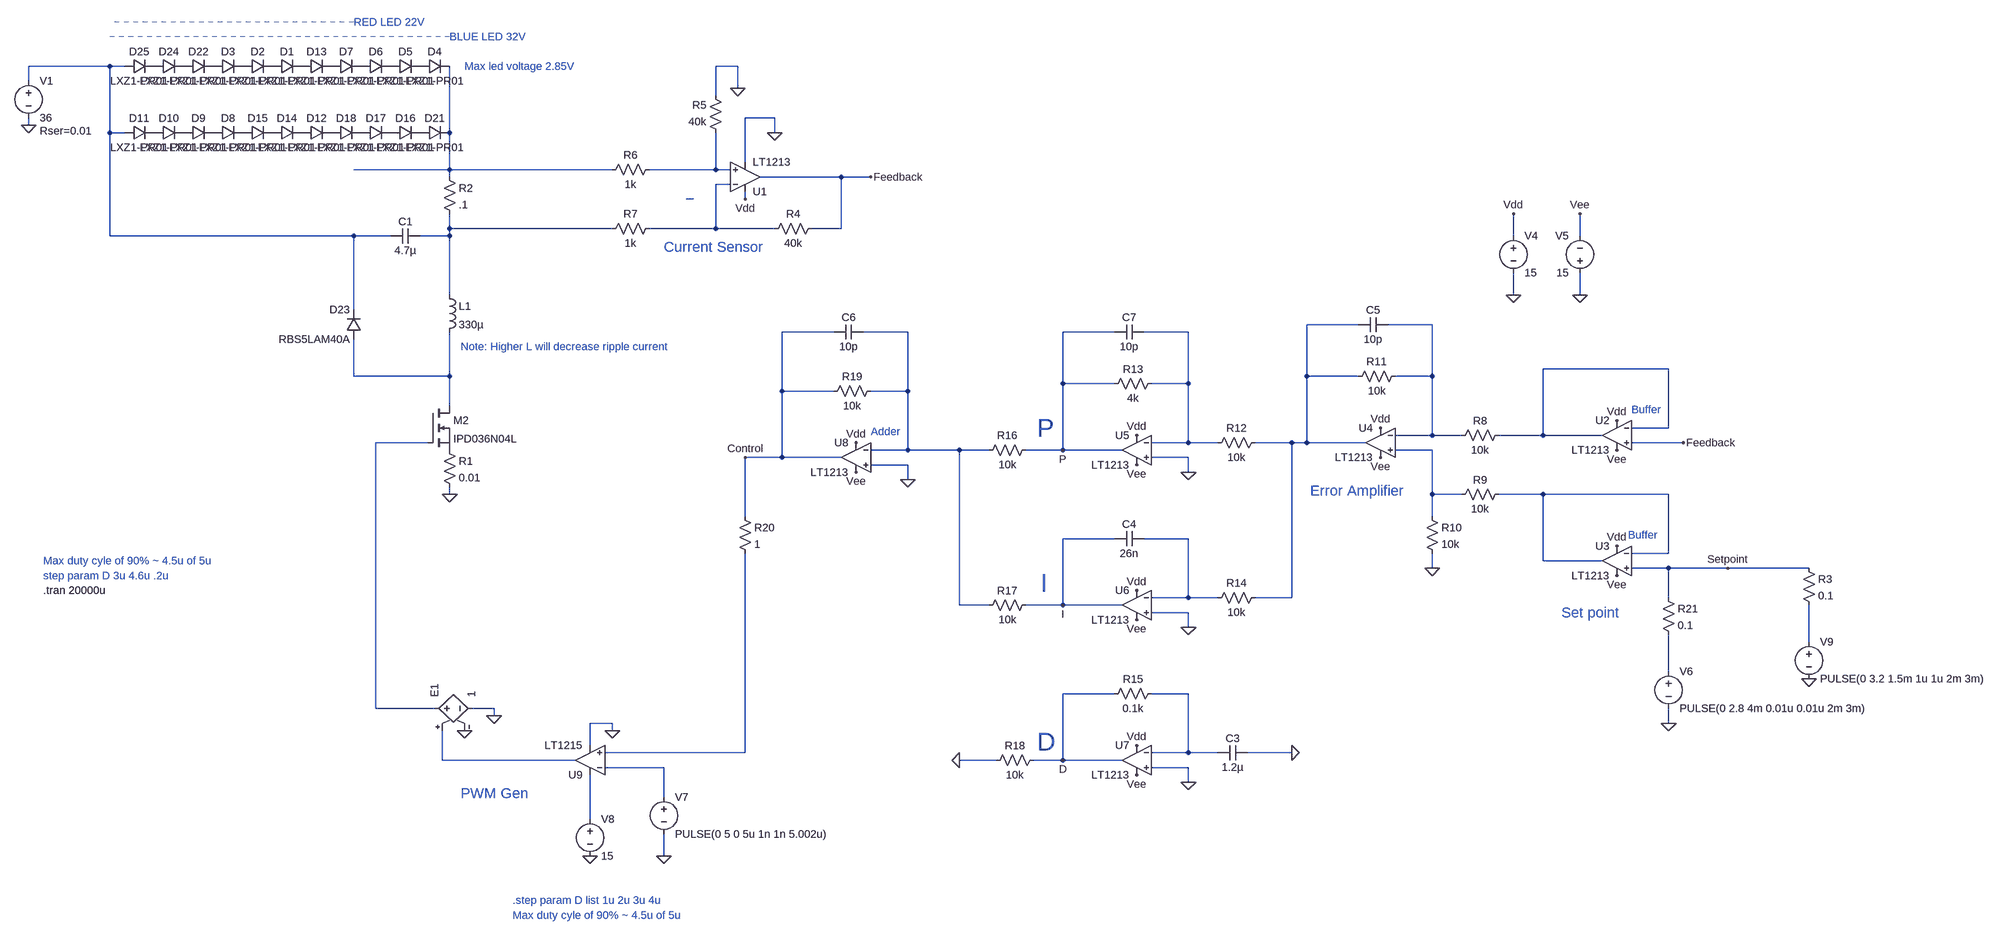
[diagram p0: schematic BuckConvertorTestsV3.asc]
BuckConvertorTestsV3.asc, the LTspice schematic file:
Version 4.1
SHEET 1 5836 2960
WIRE -480 512 -656 512
WIRE -448 512 -480 512
WIRE 880 512 832 512
WIRE -656 544 -656 512
WIRE 880 560 880 512
WIRE 832 576 832 512
WIRE 960 624 896 624
WIRE -656 640 -656 624
WIRE -480 656 -480 512
WIRE -448 656 -480 656
WIRE 256 656 256 512
WIRE 960 656 960 624
WIRE 896 720 896 624
WIRE 256 736 256 656
WIRE 256 736 48 736
WIRE 608 736 256 736
WIRE 832 736 832 656
WIRE 832 736 688 736
WIRE 864 736 832 736
WIRE 256 752 256 736
WIRE 1104 752 928 752
WIRE 1168 752 1104 752
WIRE 864 768 832 768
WIRE 784 800 768 800
WIRE 896 800 896 784
WIRE 256 864 256 832
WIRE 608 864 256 864
WIRE 832 864 832 768
WIRE 832 864 688 864
WIRE 960 864 832 864
WIRE 1104 864 1104 752
WIRE 1104 864 1040 864
WIRE -480 880 -480 656
WIRE 48 880 -480 880
WIRE 128 880 48 880
WIRE 256 880 256 864
WIRE 256 880 192 880
WIRE 2560 880 2560 832
WIRE 2704 880 2704 832
WIRE 256 1008 256 880
WIRE 2560 1008 2560 960
WIRE 2704 1008 2704 960
WIRE 48 1040 48 880
WIRE 2224 1072 2112 1072
WIRE 2384 1072 2288 1072
WIRE 1088 1088 976 1088
WIRE 1248 1088 1152 1088
WIRE 1696 1088 1584 1088
WIRE 1856 1088 1760 1088
WIRE 2896 1168 2624 1168
WIRE 48 1184 48 1104
WIRE 256 1184 256 1088
WIRE 256 1184 48 1184
WIRE 2112 1184 2112 1072
WIRE 2224 1184 2112 1184
WIRE 2384 1184 2384 1072
WIRE 2384 1184 2304 1184
WIRE 1584 1200 1584 1088
WIRE 1696 1200 1584 1200
WIRE 1856 1200 1856 1088
WIRE 1856 1200 1776 1200
WIRE 976 1216 976 1088
WIRE 1088 1216 976 1216
WIRE 1248 1216 1248 1088
WIRE 1248 1216 1168 1216
WIRE 256 1248 256 1184
WIRE 2896 1296 2896 1168
WIRE 2896 1296 2816 1296
WIRE 2384 1312 2384 1184
WIRE 2384 1312 2304 1312
WIRE 2448 1312 2384 1312
WIRE 2624 1312 2624 1168
WIRE 2624 1312 2528 1312
WIRE 2752 1312 2624 1312
WIRE 208 1328 96 1328
WIRE 1856 1328 1856 1200
WIRE 1856 1328 1776 1328
WIRE 1920 1328 1856 1328
WIRE 2080 1328 2000 1328
WIRE 2112 1328 2112 1184
WIRE 2112 1328 2080 1328
WIRE 2240 1328 2112 1328
WIRE 2928 1328 2816 1328
WIRE 1248 1344 1248 1216
WIRE 1248 1344 1168 1344
WIRE 1360 1344 1248 1344
WIRE 1424 1344 1360 1344
WIRE 1584 1344 1584 1200
WIRE 1584 1344 1504 1344
WIRE 1712 1344 1584 1344
WIRE 2384 1344 2304 1344
WIRE 976 1360 976 1216
WIRE 976 1360 896 1360
WIRE 1104 1360 976 1360
WIRE 1856 1360 1776 1360
WIRE 1248 1376 1168 1376
WIRE 1856 1392 1856 1360
WIRE 1248 1408 1248 1376
WIRE 256 1440 256 1424
WIRE 2384 1440 2384 1344
WIRE 2448 1440 2384 1440
WIRE 2624 1440 2528 1440
WIRE 2896 1440 2624 1440
WIRE 896 1488 896 1360
WIRE 2384 1488 2384 1440
WIRE 1696 1536 1584 1536
WIRE 1856 1536 1760 1536
WIRE 2896 1568 2896 1440
WIRE 2896 1568 2816 1568
WIRE 2624 1584 2624 1440
WIRE 2752 1584 2624 1584
WIRE 2384 1600 2384 1568
WIRE 2896 1600 2816 1600
WIRE 3024 1600 2896 1600
WIRE 3200 1600 3024 1600
WIRE 1856 1664 1856 1536
WIRE 1856 1664 1776 1664
WIRE 1920 1664 1856 1664
WIRE 2080 1664 2080 1328
WIRE 2080 1664 2000 1664
WIRE 2896 1664 2896 1600
WIRE 1360 1680 1360 1344
WIRE 1424 1680 1360 1680
WIRE 1584 1680 1584 1536
WIRE 1584 1680 1504 1680
WIRE 1712 1680 1584 1680
WIRE 1856 1696 1776 1696
WIRE 1856 1728 1856 1696
WIRE 3200 1760 3200 1680
WIRE 2896 1824 2896 1744
WIRE 1696 1872 1584 1872
WIRE 1856 1872 1776 1872
WIRE 96 1904 96 1328
WIRE 224 1904 96 1904
WIRE 352 1904 304 1904
WIRE 352 1920 352 1904
WIRE 608 1936 560 1936
WIRE 2896 1936 2896 1904
WIRE 608 1952 608 1936
WIRE 560 1984 560 1936
WIRE 896 2000 896 1568
WIRE 896 2000 592 2000
WIRE 1856 2000 1856 1872
WIRE 1856 2000 1776 2000
WIRE 1920 2000 1856 2000
WIRE 2080 2000 1984 2000
WIRE 240 2016 240 1952
WIRE 528 2016 240 2016
WIRE 1440 2016 1360 2016
WIRE 1584 2016 1584 1872
WIRE 1584 2016 1520 2016
WIRE 1712 2016 1584 2016
WIRE 720 2032 592 2032
WIRE 1856 2032 1776 2032
WIRE 1856 2064 1856 2032
WIRE 720 2096 720 2032
WIRE 560 2144 560 2048
WIRE 720 2224 720 2176
FLAG -656 640 0
FLAG 256 1440 0
FLAG 2560 1008 0
FLAG 2704 1008 0
FLAG 2560 832 Vdd
FLAG 2704 832 Vee
FLAG 896 800 Vdd
FLAG 880 560 0
FLAG 2928 1328 Feedback
FLAG 2784 1280 Vdd
FLAG 2784 1552 Vdd
FLAG 2784 1344 Vee
FLAG 2784 1616 Vee
FLAG 2896 1936 0
FLAG 2272 1296 Vdd
FLAG 2272 1360 Vee
FLAG 2384 1600 0
FLAG 1744 1312 Vdd
FLAG 1744 1376 Vee
FLAG 1744 1648 Vdd
FLAG 1744 1712 Vee
FLAG 1744 1984 Vdd
FLAG 1744 2048 Vee
FLAG 1856 1392 0
FLAG 1856 1728 0
FLAG 1856 2064 0
FLAG 1136 1328 Vdd
FLAG 1136 1392 Vee
FLAG 1248 1408 0
FLAG 896 1360 Control
FLAG 720 2224 0
FLAG 608 1952 0
FLAG 288 1952 0
FLAG 352 1920 0
FLAG 560 2224 0
FLAG 960 656 0
FLAG 1584 1344 P
FLAG 1584 1680 I
FLAG 3200 1840 0
FLAG 3024 1600 Setpoint
FLAG 1584 2016 D
FLAG 1168 752 Feedback
FLAG 2080 2000 0
FLAG 1360 2016 0
SYMBOL voltage -656 528 R0
WINDOW 123 0 0 Left 0
WINDOW 39 24 124 Left 2
SYMATTR SpiceLine Rser=0.01
SYMATTR InstName V1
SYMATTR Value 36
SYMBOL diode -64 528 R270
WINDOW 0 32 32 VTop 2
WINDOW 3 0 32 VBottom 2
SYMATTR InstName D13
SYMATTR Value LXZ1-PR01
SYMBOL nmos 208 1248 R0
SYMATTR InstName M2
SYMATTR Value IPD036N04L
SYMBOL cap 192 864 R90
WINDOW 0 0 32 VBottom 2
WINDOW 3 32 32 VTop 2
SYMATTR InstName C1
SYMATTR Value 4.7µ
SYMATTR SpiceLine Rser=0.05
SYMBOL diode 64 1104 R180
WINDOW 0 24 64 Left 2
WINDOW 3 24 0 Left 2
SYMATTR InstName D23
SYMATTR Value RBS5LAM40A
SYMBOL ind 240 992 R0
SYMATTR InstName L1
SYMATTR Value 330µ
SYMATTR SpiceLine Rser=1m
SYMBOL res 240 1328 R0
SYMATTR InstName R1
SYMATTR Value 0.01
SYMBOL res 240 736 R0
SYMATTR InstName R2
SYMATTR Value .1
SYMBOL diode -128 528 R270
WINDOW 0 32 32 VTop 2
WINDOW 3 0 32 VBottom 2
SYMATTR InstName D1
SYMATTR Value LXZ1-PR01
SYMBOL diode -192 528 R270
WINDOW 0 32 32 VTop 2
WINDOW 3 0 32 VBottom 2
SYMATTR InstName D2
SYMATTR Value LXZ1-PR01
SYMBOL diode -256 528 R270
WINDOW 0 32 32 VTop 2
WINDOW 3 0 32 VBottom 2
SYMATTR InstName D3
SYMATTR Value LXZ1-PR01
SYMBOL diode 192 528 R270
WINDOW 0 32 32 VTop 2
WINDOW 3 0 32 VBottom 2
SYMATTR InstName D4
SYMATTR Value LXZ1-PR01
SYMBOL diode 128 528 R270
WINDOW 0 32 32 VTop 2
WINDOW 3 0 32 VBottom 2
SYMATTR InstName D5
SYMATTR Value LXZ1-PR01
SYMBOL diode 64 528 R270
WINDOW 0 32 32 VTop 2
WINDOW 3 0 32 VBottom 2
SYMATTR InstName D6
SYMATTR Value LXZ1-PR01
SYMBOL diode 0 528 R270
WINDOW 0 32 32 VTop 2
WINDOW 3 0 32 VBottom 2
SYMATTR InstName D7
SYMATTR Value LXZ1-PR01
SYMBOL diode -256 672 R270
WINDOW 0 32 32 VTop 2
WINDOW 3 0 32 VBottom 2
SYMATTR InstName D8
SYMATTR Value LXZ1-PR01
SYMBOL diode -320 672 R270
WINDOW 0 32 32 VTop 2
WINDOW 3 0 32 VBottom 2
SYMATTR InstName D9
SYMATTR Value LXZ1-PR01
SYMBOL diode -384 672 R270
WINDOW 0 32 32 VTop 2
WINDOW 3 0 32 VBottom 2
SYMATTR InstName D10
SYMATTR Value LXZ1-PR01
SYMBOL diode -448 672 R270
WINDOW 0 32 32 VTop 2
WINDOW 3 0 32 VBottom 2
SYMATTR InstName D11
SYMATTR Value LXZ1-PR01
SYMBOL diode -64 672 R270
WINDOW 0 32 32 VTop 2
WINDOW 3 0 32 VBottom 2
SYMATTR InstName D12
SYMATTR Value LXZ1-PR01
SYMBOL diode -128 672 R270
WINDOW 0 32 32 VTop 2
WINDOW 3 0 32 VBottom 2
SYMATTR InstName D14
SYMATTR Value LXZ1-PR01
SYMBOL diode -192 672 R270
WINDOW 0 32 32 VTop 2
WINDOW 3 0 32 VBottom 2
SYMATTR InstName D15
SYMATTR Value LXZ1-PR01
SYMBOL diode 128 672 R270
WINDOW 0 32 32 VTop 2
WINDOW 3 0 32 VBottom 2
SYMATTR InstName D16
SYMATTR Value LXZ1-PR01
SYMBOL diode 64 672 R270
WINDOW 0 32 32 VTop 2
WINDOW 3 0 32 VBottom 2
SYMATTR InstName D17
SYMATTR Value LXZ1-PR01
SYMBOL diode 0 672 R270
WINDOW 0 32 32 VTop 2
WINDOW 3 0 32 VBottom 2
SYMATTR InstName D18
SYMATTR Value LXZ1-PR01
SYMBOL diode 192 672 R270
WINDOW 0 32 32 VTop 2
WINDOW 3 0 32 VBottom 2
SYMATTR InstName D21
SYMATTR Value LXZ1-PR01
SYMBOL diode -320 528 R270
WINDOW 0 32 32 VTop 2
WINDOW 3 0 32 VBottom 2
SYMATTR InstName D22
SYMATTR Value LXZ1-PR01
SYMBOL diode -384 528 R270
WINDOW 0 32 32 VTop 2
WINDOW 3 0 32 VBottom 2
SYMATTR InstName D24
SYMATTR Value LXZ1-PR01
SYMBOL diode -448 528 R270
WINDOW 0 32 32 VTop 2
WINDOW 3 0 32 VBottom 2
SYMATTR InstName D25
SYMATTR Value LXZ1-PR01
SYMBOL OpAmps\\LT1213 896 816 M180
SYMATTR InstName U1
SYMBOL voltage 2560 864 R0
WINDOW 123 0 0 Left 0
WINDOW 39 0 0 Left 0
SYMATTR InstName V4
SYMATTR Value 15
SYMBOL voltage 2704 976 R180
WINDOW 0 24 96 Left 2
WINDOW 3 24 16 Left 2
WINDOW 123 0 0 Left 0
WINDOW 39 0 0 Left 0
SYMATTR InstName V5
SYMATTR Value 15
SYMBOL res 1056 848 R90
WINDOW 0 0 56 VBottom 2
WINDOW 3 32 56 VTop 2
SYMATTR InstName R4
SYMATTR Value 40k
SYMBOL res 848 672 R180
WINDOW 0 36 76 Left 2
WINDOW 3 36 40 Left 2
SYMATTR InstName R5
SYMATTR Value 40k
SYMBOL res 704 720 R90
WINDOW 0 0 56 VBottom 2
WINDOW 3 32 56 VTop 2
SYMATTR InstName R6
SYMATTR Value 1k
SYMBOL res 704 848 R90
WINDOW 0 0 56 VBottom 2
WINDOW 3 32 56 VTop 2
SYMATTR InstName R7
SYMATTR Value 1k
SYMBOL OpAmps\\LT1213 2784 1248 M0
SYMATTR InstName U2
SYMBOL voltage 2896 1808 R0
WINDOW 123 0 0 Left 0
WINDOW 39 0 0 Left 0
SYMATTR InstName V6
SYMATTR Value PULSE(0 2.8 4m 0.01u 0.01u 2m 3m)
SYMBOL res 2544 1296 R90
WINDOW 0 0 56 VBottom 2
WINDOW 3 32 56 VTop 2
SYMATTR InstName R8
SYMATTR Value 10k
SYMBOL res 2544 1424 R90
WINDOW 0 0 56 VBottom 2
WINDOW 3 32 56 VTop 2
SYMATTR InstName R9
SYMATTR Value 10k
SYMBOL res 2368 1472 R0
SYMATTR InstName R10
SYMATTR Value 10k
SYMBOL res 2320 1168 R90
WINDOW 0 0 56 VBottom 2
WINDOW 3 32 56 VTop 2
SYMATTR InstName R11
SYMATTR Value 10k
SYMBOL res 2016 1312 R90
WINDOW 0 0 56 VBottom 2
WINDOW 3 32 56 VTop 2
SYMATTR InstName R12
SYMATTR Value 10k
SYMBOL res 1792 1184 R90
WINDOW 0 0 56 VBottom 2
WINDOW 3 32 56 VTop 2
SYMATTR InstName R13
SYMATTR Value 4k
SYMBOL res 2016 1648 R90
WINDOW 0 0 56 VBottom 2
WINDOW 3 32 56 VTop 2
SYMATTR InstName R14
SYMATTR Value 10k
SYMBOL res 1792 1856 R90
WINDOW 0 0 56 VBottom 2
WINDOW 3 32 56 VTop 2
SYMATTR InstName R15
SYMATTR Value 0.1k
SYMBOL cap 1984 1984 R90
WINDOW 0 0 32 VBottom 2
WINDOW 3 32 32 VTop 2
SYMATTR InstName C3
SYMATTR Value 1.2µ
SYMATTR SpiceLine Rser=0.01
SYMBOL cap 1760 1520 R90
WINDOW 0 0 32 VBottom 2
WINDOW 3 32 32 VTop 2
SYMATTR InstName C4
SYMATTR Value 26n
SYMBOL res 1520 1328 R90
WINDOW 0 0 56 VBottom 2
WINDOW 3 32 56 VTop 2
SYMATTR InstName R16
SYMATTR Value 10k
SYMBOL res 1520 1664 R90
WINDOW 0 0 56 VBottom 2
WINDOW 3 32 56 VTop 2
SYMATTR InstName R17
SYMATTR Value 10k
SYMBOL res 1536 2000 R90
WINDOW 0 0 56 VBottom 2
WINDOW 3 32 56 VTop 2
SYMATTR InstName R18
SYMATTR Value 10k
SYMBOL res 1184 1200 R90
WINDOW 0 0 56 VBottom 2
WINDOW 3 32 56 VTop 2
SYMATTR InstName R19
SYMATTR Value 10k
SYMBOL OpAmps\\LT1213 2784 1520 M0
SYMATTR InstName U3
SYMBOL OpAmps\\LT1213 2272 1264 M0
SYMATTR InstName U4
SYMBOL OpAmps\\LT1213 1744 1280 M0
SYMATTR InstName U5
SYMBOL OpAmps\\LT1213 1744 1616 M0
SYMATTR InstName U6
SYMBOL OpAmps\\LT1213 1744 1952 M0
SYMATTR InstName U7
SYMBOL OpAmps\\LT1213 1136 1296 M0
SYMATTR InstName U8
SYMBOL voltage 720 2080 R0
WINDOW 123 0 0 Left 0
WINDOW 39 0 0 Left 0
SYMATTR InstName V7
SYMATTR Value PULSE(0 5 0 5u 1n 1n 5.002u)
SYMBOL res 880 1472 R0
SYMATTR InstName R20
SYMATTR Value 1
SYMBOL e 208 1904 R270
SYMATTR InstName E1
SYMATTR Value 1
SYMBOL OpAmps\\LT1215 560 2080 R180
SYMATTR InstName U9
SYMBOL voltage 560 2128 R0
WINDOW 123 0 0 Left 0
WINDOW 39 0 0 Left 0
SYMATTR InstName V8
SYMATTR Value 15
SYMBOL voltage 3200 1744 R0
WINDOW 123 0 0 Left 0
WINDOW 39 0 0 Left 0
SYMATTR InstName V9
SYMATTR Value PULSE(0 3.2 1.5m 1u 1u 2m 3m)
SYMBOL res 2880 1648 R0
SYMATTR InstName R21
SYMATTR Value 0.1
SYMBOL cap 2288 1056 R90
WINDOW 0 0 32 VBottom 2
WINDOW 3 32 32 VTop 2
SYMATTR InstName C5
SYMATTR Value 10p
SYMBOL cap 1152 1072 R90
WINDOW 0 0 32 VBottom 2
WINDOW 3 32 32 VTop 2
SYMATTR InstName C6
SYMATTR Value 10p
SYMBOL cap 1760 1072 R90
WINDOW 0 0 32 VBottom 2
WINDOW 3 32 32 VTop 2
SYMATTR InstName C7
SYMATTR Value 10p
SYMBOL res 3184 1584 R0
SYMATTR InstName R3
SYMATTR Value 0.1
TEXT -624 1648 Left 2 !.tran 20000u
TEXT 288 512 Left 2 ;Max led voltage 2.85V
TEXT -624 1616 Left 2 ;step param D 3u 4.6u .2u
TEXT -624 1584 Left 2 ;Max duty cyle of 90% ~ 4.5u of 5u
TEXT 280 1120 Left 2 ;Note: Higher L will decrease ripple current
TEXT 392 2320 Left 2 ;.step param D list 1u 2u 3u 4u
TEXT 392 2352 Left 2 ;Max duty cyle of 90% ~ 4.5u of 5u
TEXT 2120 1432 Left 3 ;Error Amplifier
TEXT 1528 1296 Left 5 ;P
TEXT 1536 1632 Left 5 ;I
TEXT 1528 1976 Left 5 ;D
TEXT 2664 1696 Left 3 ;Set point
TEXT 2816 1256 Left 2 ;Buffer
TEXT 2808 1528 Left 2 ;Buffer
TEXT 280 2088 Left 3 ;PWM Gen
TEXT 1168 1304 Left 2 ;Adder
TEXT 720 904 Left 3 ;Current Sensor
TEXT 48 416 Left 2 ;RED LED 22V
TEXT 256 448 Left 2 ;BLUE LED 32V
LINE Normal 256 448 -480 448 2
LINE Normal 48 416 -480 416 2

The netlist it stands for:
* BuckConvertorTestsV3.asc
V1 N001 0 36 Rser=0.01
D13 P001 P002 LXZ1-PR01
M2 N012 N013 P003 P003 IPD036N04L
C1 N006 N001 4.7µ Rser=0.05
D23 N012 N001 RBS5LAM40A
L1 N006 N012 330µ Rser=1m
R1 P003 0 0.01
R2 N002 N006 .1
D1 P004 P001 LXZ1-PR01
D2 P005 P004 LXZ1-PR01
D3 P006 P005 LXZ1-PR01
D4 P007 N002 LXZ1-PR01
D5 P008 P007 LXZ1-PR01
D6 P009 P008 LXZ1-PR01
D7 P002 P009 LXZ1-PR01
D8 P010 P011 LXZ1-PR01
D9 P012 P010 LXZ1-PR01
D10 P013 P012 LXZ1-PR01
D11 N001 P013 LXZ1-PR01
D12 P014 P015 LXZ1-PR01
D14 P016 P014 LXZ1-PR01
D15 P011 P016 LXZ1-PR01
D16 P017 P018 LXZ1-PR01
D17 P019 P017 LXZ1-PR01
D18 P015 P019 LXZ1-PR01
D21 P018 N002 LXZ1-PR01
D22 P020 P006 LXZ1-PR01
D24 P021 P020 LXZ1-PR01
D25 N001 P021 LXZ1-PR01
X§U1 N003 N004 Vdd 0 Feedback LT1213  ; pins In+ In- V+ V- OUT
V4 Vdd 0 15
V5 0 Vee 15
R4 Feedback N004 40k
R5 N003 0 40k
R6 N003 N002 1k
R7 N004 N006 1k
X§U2 Feedback N011 Vdd Vee N011 LT1213  ; pins In+ In- V+ V- OUT
V6 N018 0 PULSE(0 2.8 4m 0.01u 0.01u 2m 3m)
R8 N011 N008 10k
R9 N015 N014 10k
R10 N014 0 10k
R11 N008 N007 10k
R12 N007 N010 10k
R13 N010 P 4k
R14 N007 N016 10k
R15 N019 D 0.1k
C3 0 N019 1.2µ Rser=0.01
C4 N016 I 26n
R16 P N009 10k
R17 I N009 10k
R18 D 0 10k
R19 N009 Control 10k
X§U3 Setpoint N015 Vdd Vee N015 LT1213  ; pins In+ In- V+ V- OUT
X§U4 N014 N008 Vdd Vee N007 LT1213  ; pins In+ In- V+ V- OUT
X§U5 0 N010 Vdd Vee P LT1213  ; pins In+ In- V+ V- OUT
X§U6 0 N016 Vdd Vee I LT1213  ; pins In+ In- V+ V- OUT
X§U7 0 N019 Vdd Vee D LT1213  ; pins In+ In- V+ V- OUT
X§U8 0 N009 Vdd Vee Control LT1213  ; pins In+ In- V+ V- OUT
V7 N022 0 PULSE(0 5 0 5u 1n 1n 5.002u)
R20 Control N020 1
E1 N013 0 N021 0 1
X§U9 N020 N022 N023 0 N021 LT1215  ; pins In+ In- V+ V- OUT
V8 N023 0 15
V9 N017 0 PULSE(0 3.2 1.5m 1u 1u 2m 3m)
R21 Setpoint N018 0.1
C5 N008 N007 10p
C6 N009 Control 10p
C7 N010 P 10p
R3 Setpoint N017 0.1
.model D D
.lib standard.dio
.model NMOS NMOS
.model PMOS PMOS
.lib standard.mos
.tran 20000u
* Max led voltage 2.85V
* step param D 3u 4.6u .2u
* Max duty cyle of 90% ~ 4.5u of 5u
* Note: Higher L will decrease ripple current
* .step param D list 1u 2u 3u 4u
* Max duty cyle of 90% ~ 4.5u of 5u
* Error Amplifier
* P
* I
* D
* Set point
* Buffer
* Buffer
* PWM Gen
* Adder
* Current Sensor
* RED LED 22V
* BLUE LED 32V
.lib LTC.lib
.backanno
.end